# Altium schematic sheet MainSchema.SchDoc
size A4
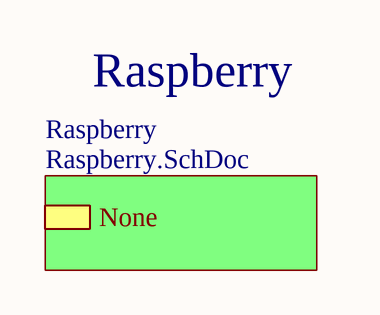
[diagram p0: MainSchema.SchDoc]

## Sub-sheets
Raspberry = Raspberry.SchDoc: None

## Notes on the sheet
- Raspberry